# Altium schematic sheet REG_top.SchDoc
size 177 x 106 mm; SheetNumber: 1; SheetTotal: 2
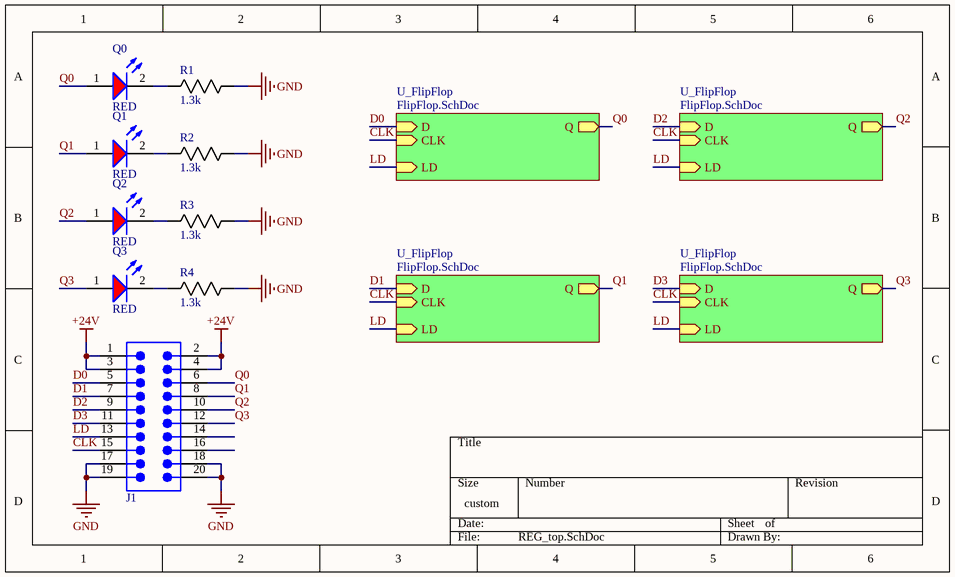
[diagram p0: REG_top.SchDoc]

## Parts
J1  Con 2.54mm 10x2pos  [Con 2.54mm 10x2pos]  (value not drawn)
Q0  RED  [LED RED 151051RS11000]
Q1  RED  [LED RED 151051RS11000]
Q2  RED  [LED RED 151051RS11000]
Q3  RED  [LED RED 151051RS11000]
R1  1.3k  [RES 2512]
R2  1.3k  [RES 2512]
R3  1.3k  [RES 2512]
R4  1.3k  [RES 2512]

## Sub-sheets
U_FlipFlop = FlipFlop.SchDoc: Q (out), CLK (in), LD (in), D (in)
U_FlipFlop = FlipFlop.SchDoc: Q (out), CLK (in), LD (in), D (in)
U_FlipFlop = FlipFlop.SchDoc: Q (out), CLK (in), LD (in), D (in)
U_FlipFlop = FlipFlop.SchDoc: Q (out), CLK (in), LD (in), D (in)

## Nets
+24V: J1.1 J1.2 J1.3 J1.4
GND: J1.17 J1.18 J1.19 J1.20 R1.2 R2.2 R3.2 R4.2
CLK: J1.15 ; sheet U_FlipFlop/CLK, sheet U_FlipFlop/CLK, sheet U_FlipFlop/CLK, sheet U_FlipFlop/CLK
D0: J1.5 ; sheet U_FlipFlop/D
D1: J1.7 ; sheet U_FlipFlop/D
D2: J1.9 ; sheet U_FlipFlop/D
D3: J1.11 ; sheet U_FlipFlop/D
LD: J1.13 ; sheet U_FlipFlop/LD, sheet U_FlipFlop/LD, sheet U_FlipFlop/LD, sheet U_FlipFlop/LD
Q0: J1.6 Q0.1(A) ; sheet U_FlipFlop/Q
Q1: J1.8 Q1.1(A) ; sheet U_FlipFlop/Q
Q2: J1.10 Q2.1(A) ; sheet U_FlipFlop/Q
Q3: J1.12 Q3.1(A) ; sheet U_FlipFlop/Q
NetQ0_2: Q0.2(K) R1.1
NetQ1_2: Q1.2(K) R2.1
NetQ2_2: Q2.2(K) R3.1
NetQ3_2: Q3.2(K) R4.1

Not connected (* = marked no-connect by the designer): J1 14 16

## Library data of the parts
J1 = Con 2.54mm 10x2pos: WR-BHD Straight Male, Box Header, Through Hole, 2 Rows, 20 Contacts, 2.54mm Pitch; Manufacturer: Wurth Elektronik; Manufacturer Part Number: 61202021621; Connector Type: Male Pin; Contact Resistance: 20mΩ; Current Rating: 3A; Insulation: Insulated; Insulation Resistance: 1GΩ; Number of Contacts: 20; Operating Supply Voltage: 250V; Supplier: DigiKey; Supplier Part Number: 732-2096-ND; RoHS: Compliant; Category: Headers and Wire Housings; Stock: 12933; Pricing: 1=0.86, 10=0.839, 50=0.7732, 160=0.69213, 320=0.64375 (USD); Color: Black; Contact Gender: Male; Contact Material: Gold; Contact Plating: Gold; Flammability Rating: UL94 V-0; Gender: Male; Height: 9.25mm; Housing Material: PBT; Insulation Material: PBT; Lead Pitch: 2.54mm; Length: 33.06mm; Max Operating Temperature: 105°C; Min Operating Temperature: -40°C; Mounting Technology: Through Hole; Pins: 20; Number of Positions: 20; Number of Rows: 2; Orientation: Vertical; Pitch: 2.54mm; Row Spacing: 2.54mm; Termination: Through Hole; Voltage Rating: 250V; Voltage Rating (DC): 250V; Width: 33.06mm; ComponentLink1URL: https://datasheet.octopart.com:443/61202021621-W%C3%BCrth-Elektronik-datasheet-111087935.pdf?src-supplier=Upverter; ComponentLink1Description: https://datasheet.octopart.com:443/61202021621-W%C3%BCrth-Elektronik-datasheet-111087935.pdf?src-supplier=Upverter; ComponentLink2URL: https://datasheet.octopart.com:443/61202021621-Wurth-Elektronik-datasheet-168480024.pdf?src-supplier=Wurth+Elektronik; ComponentLink2Description: https://datasheet.octopart.com:443/61202021621-Wurth-Elektronik-datasheet-168480024.pdf?src-supplier=Wurth+Elektronik; ComponentLink3URL: https://datasheet.octopart.com:443/61202021621-W%C3%BCrth-Elektronik-datasheet-149523954.pdf?src-supplier=Farnell; ComponentLink3Description: https://datasheet.octopart.com:443/61202021621-W%C3%BCrth-Elektronik-datasheet-149523954.pdf?src-supplier=Farnell; ComponentLink4URL: https://datasheet.octopart.com:443/61202021621-W%C3%BCrth-Elektronik-Midcom-datasheet-10469446.pdf?src-supplier=Farnell; ComponentLink4Description: https://datasheet.octopart.com:443/61202021621-W%C3%BCrth-Elektronik-Midcom-datasheet-10469446.pdf?src-supplier=Farnell; ComponentLink5URL: https://datasheet.octopart.com:443/61202021621-W%C3%BCrth-Elektronik-Midcom-datasheet-5367532.pdf?src-supplier=element14+APAC; ComponentLink5Description: https://datasheet.octopart.com:443/61202021621-W%C3%BCrth-Elektronik-Midcom-datasheet-5367532.pdf?src-supplier=element14+APAC
Q0-Q3 = LED RED 151051RS11000: WL-TMRC Red Color Diffused 5 mm Round Through Hole LED; Manufacturer: Wurth Elektronik; Dominant Wavelength: 645nm; Forward Current: 100mA; Forward Voltage: 2.1V; Lens Size: 5mm; Lens Style: Circular, Diffused, Round; Luminous Intensity: 30mcd; Max Reverse Voltage (DC): 5V; Peak Wavelength: 650nm; Test Current: 20mA; Viewing Angle: 60°; Wavelength: 630nm; Supplier: DigiKey; Supplier Part Number: 732-5016-ND; Manufacturer Part Number: 151051RS11000; RoHS: Compliant; Category: LEDs; Stock: 19120; Pricing: 1=0.15, 50=0.1396, 100=0.1197, 500=0.105 (USD); Case/Package: Radial; Color: Red; Height: 8.6mm; Length: 5mm; Max Operating Temperature: 85°C; Min Operating Temperature: -40°C; Mounting Technology: Through Hole; Packaging: Bulk; REACH SVHC: Unknown; Width: 5mm; ComponentLink1URL: https://datasheet.octopart.com:443/151051RS11000-Wurth-Elektronik-datasheet-168474692.pdf?src-supplier=Wurth+Elektronik; ComponentLink1Description: https://datasheet.octopart.com:443/151051RS11000-Wurth-Elektronik-datasheet-168474692.pdf?src-supplier=Wurth+Elektronik; ComponentLink2URL: https://datasheet.octopart.com:443/151051RS11000-W%C3%BCrth-Elektronik-datasheet-83005830.pdf?src-supplier=Future+Electronics; ComponentLink2Description: https://datasheet.octopart.com:443/151051RS11000-W%C3%BCrth-Elektronik-datasheet-83005830.pdf?src-supplier=Future+Electronics; ComponentLink3URL: https://datasheet.octopart.com:443/151051RS11000-W%C3%BCrth-Elektronik-datasheet-15983824.pdf?src-supplier=element14+APAC; ComponentLink3Description: https://datasheet.octopart.com:443/151051RS11000-W%C3%BCrth-Elektronik-datasheet-15983824.pdf?src-supplier=element14+APAC
R1-R4 = RES 1.3k 2512 1W: Res Thick Film 2512 1.3K Ohm 1% 1W ±100ppm/C Pad SMD Automotive T/R RMCF2512FT1K30; Manufacturer: Stackpole Electronics; Value: 1.3kΩ; Temperature Coefficient: 100ppm/°C; Voltage Rating: 500V; Working Voltage: 200V; Supplier: DigiKey; Supplier Part Number: RMCF2512FT1K30CT-ND; Manufacturer Part Number: RMCF2512FT1K30; RoHS: Compliant; Category: Chip SMD Resistors; Stock: 10417; Pricing: 1=0.24, 10=0.126, 25=0.1008, 50=0.0864, 100=0.0751, 250=0.0638, 500=0.05728, 1000=0.0521 (USD); Case/Package: 2512; China RoHS: Non-Compliant; Composition: Thick Film; Contact Plating: Tin; Depth: 3.2mm; Features: Automotive AEC-Q200; Height: 550µm; Length: 6.2992mm; Lifecycle Status: Production; Max Operating Temperature: 155°C; Max Power Dissipation: 1W; Military Standard: Not; Min Operating Temperature: -55°C; Mounting Technology: Surface Mount; Number of Terminals: 2; Number of Terminations: 2; Packaging: Tape & Reel (TR); Power Dissipation: 1W; Power Rating: 1W; Radiation Hardening: No; REACH SVHC: Yes; Schedule B: 8533210045, 8533210045|8533210045|8533210045|8533210045|8533210045; Tolerance: 1%; Width: 3.2mm; ComponentLink1URL: https://datasheet.octopart.com:443/RMCF2512FT1K30-Stackpole-Electronics-datasheet-182148065.pdf?src-supplier=IHS; ComponentLink1Description: https://datasheet.octopart.com:443/RMCF2512FT1K30-Stackpole-Electronics-datasheet-182148065.pdf?src-supplier=IHS; ComponentLink2URL: https://datasheet.octopart.com:443/RMCF2512FT1K30-Stackpole-Electronics-datasheet-28504820.pdf?src-supplier=Future+Electronics; ComponentLink2Description: https://datasheet.octopart.com:443/RMCF2512FT1K30-Stackpole-Electronics-datasheet-28504820.pdf?src-supplier=Future+Electronics; ComponentLink3URL: https://datasheet.octopart.com:443/RMCF2512FT1K30-Stackpole-Electronics-datasheet-141193804.pdf?src-supplier=Master+Electronics; ComponentLink3Description: https://datasheet.octopart.com:443/RMCF2512FT1K30-Stackpole-Electronics-datasheet-141193804.pdf?src-supplier=Master+Electronics; ComponentLink4URL: https://datasheet.octopart.com:443/RMCF2512FT1K30-Stackpole-Electronics-datasheet-189104163.pdf?src-supplier=Master+Electronics; ComponentLink4Description: https://datasheet.octopart.com:443/RMCF2512FT1K30-Stackpole-Electronics-datasheet-189104163.pdf?src-supplier=Master+Electronics; ComponentLink5URL: https://datasheet.octopart.com:443/RMCF2512FT1K30-Stackpole-Electronics-datasheet-116606903.pdf?src-supplier=Master+Electronics; ComponentLink5Description: https://datasheet.octopart.com:443/RMCF2512FT1K30-Stackpole-Electronics-datasheet-116606903.pdf?src-supplier=Master+Electronics; ComponentLink6URL: https://datasheet.octopart.com:443/RMCF2512FT1K30-Stackpole-Electronics-datasheet-62091608.pdf?src-supplier=Stackpole+Electronics; ComponentLink6Description: https://datasheet.octopart.com:443/RMCF2512FT1K30-Stackpole-Electronics-datasheet-62091608.pdf?src-supplier=Stackpole+Electronics; ComponentLink7URL: https://datasheet.octopart.com:443/RMCF2512FT1K30-Stackpole-Electronics-datasheet-12534581.pdf?src-supplier=Stackpole+Electronics; ComponentLink7Description: https://datasheet.octopart.com:443/RMCF2512FT1K30-Stackpole-Electronics-datasheet-12534581.pdf?src-supplier=Stackpole+Electronics; ComponentLink8URL: https://datasheet.octopart.com:443/RMCF2512FT1K30-Stackpole-Electronics-datasheet-10788263.pdf?src-supplier=Stackpole+Electronics; ComponentLink8Description: https://datasheet.octopart.com:443/RMCF2512FT1K30-Stackpole-Electronics-datasheet-10788263.pdf?src-supplier=Stackpole+Electronics; ComponentLink9URL: http://sigma.octopart.com:80/15940719/materials_sheet/Stackpole-Electronics-RMCF2512FT1K30.pdf?src-supplier=Compliance+Statements; ComponentLink9Description: http://sigma.octopart.com:80/15940719/materials_sheet/Stackpole-Electronics-RMCF2512FT1K30.pdf?src-supplier=Compliance+Statements; ComponentLink10URL: http://sigma.octopart.com:80/141158212/rohs_statement/Stackpole-Electronics-RMCF2512FT1K30.pdf?src-supplier=Compliance+Statements; ComponentLink10Description: http://sigma.octopart.com:80/141158212/rohs_statement/Stackpole-Electronics-RMCF2512FT1K30.pdf?src-supplier=Compliance+Statements; ComponentLink11URL: http://sigma.octopart.com:80/141158211/reach_statement/Stackpole-Electronics-RMCF2512FT1K30.pdf?src-supplier=Compliance+Statements; ComponentLink11Description: http://sigma.octopart.com:80/141158211/reach_statement/Stackpole-Electronics-RMCF2512FT1K30.pdf?src-supplier=Compliance+Statements